# Altium schematic sheet Output.SchDoc
size A4
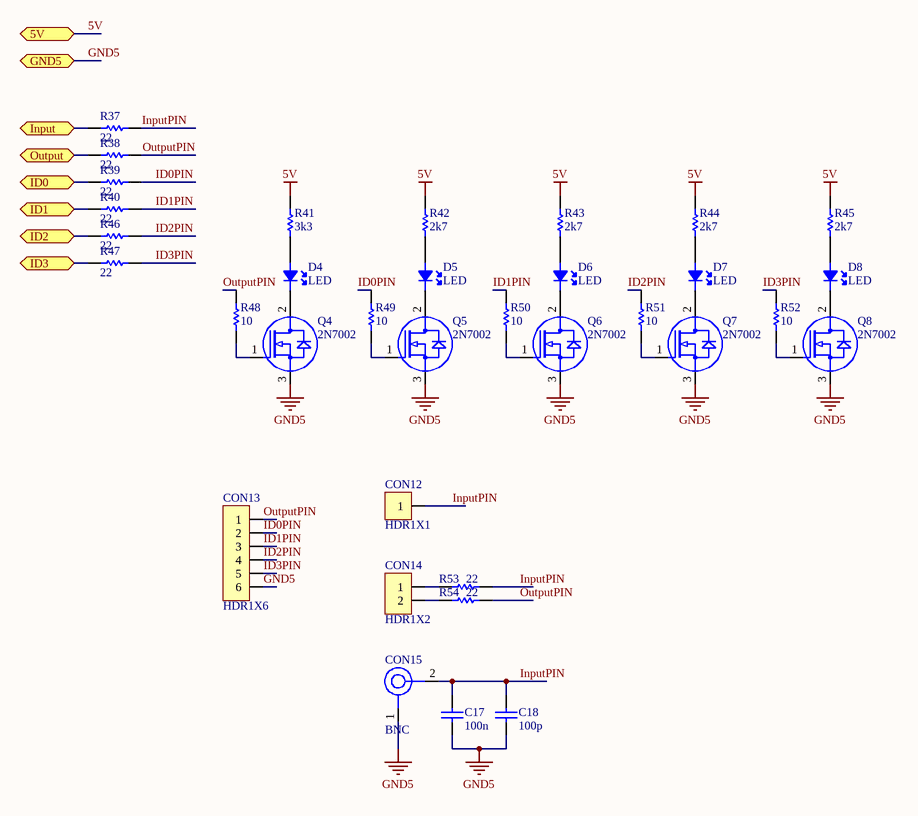
[diagram p0: Output.SchDoc]

## Parts
C17  100n  [0805C]
C18  100p  [0805C]
CON12  HDR1X1  [HDR1X1]
CON13  HDR1X6  [HDR1X6RAST]
CON14  HDR1X2  [HDR1X2RAST]
CON15  BNC  [BNC_THD]
D4  LED  [0805LED]
D5  LED  [0805LED]
D6  LED  [0805LED]
D7  LED  [0805LED]
D8  LED  [0805LED]
Q4  2N7002  [SOT23]
Q5  2N7002  [SOT23]
Q6  2N7002  [SOT23]
Q7  2N7002  [SOT23]
Q8  2N7002  [SOT23]
R37  22  [0805R]
R38  22  [0805R]
R39  22  [0805R]
R40  22  [0805R]
R41  3k3  [0805R]
R42  2k7  [0805R]
R43  2k7  [0805R]
R44  2k7  [0805R]
R45  2k7  [0805R]
R46  22  [0805R]
R47  22  [0805R]
R48  10  [0805R]
R49  10  [0805R]
R50  10  [0805R]
R51  10  [0805R]
R52  10  [0805R]
R53  22  [0805R]
R54  22  [0805R]

## Ports
5V, GND5, ID0, ID1, ID2, ID3, Input, Output

## Nets
5V: R41.2 R42.2 R43.2 R44.2 R45.2 ; port 5V
GND5: C17.1 C18.1 CON13.6 CON15.1 Q4.3(SOURCE) Q5.3(SOURCE) Q6.3(SOURCE) Q7.3(SOURCE) Q8.3(SOURCE) ; port GND5
ID0: R39.1 ; port ID0
ID0PIN: CON13.2 R39.2 R49.2
ID1: R40.1 ; port ID1
ID1PIN: CON13.3 R40.2 R50.2
ID2: R46.1 ; port ID2
ID2PIN: CON13.4 R46.2 R51.2
ID3: R47.1 ; port ID3
ID3PIN: CON13.5 R47.2 R52.2
Input: R37.1 ; port Input
InputPIN: C17.2 C18.2 CON12.1 CON15.2 R37.2 R53.2
Output: R38.1 ; port Output
OutputPIN: CON13.1 R38.2 R48.2 R54.2
NetCON14_1: CON14.1 R53.1
NetCON14_2: CON14.2 R54.1
NetD4_1: D4.1(A) R41.1
NetD4_2: D4.2(K) Q4.2(DRAIN)
NetD5_1: D5.1(A) R42.1
NetD5_2: D5.2(K) Q5.2(DRAIN)
NetD6_1: D6.1(A) R43.1
NetD6_2: D6.2(K) Q6.2(DRAIN)
NetD7_1: D7.1(A) R44.1
NetD7_2: D7.2(K) Q7.2(DRAIN)
NetD8_1: D8.1(A) R45.1
NetD8_2: D8.2(K) Q8.2(DRAIN)
NetQ4_1: Q4.1(GATE) R48.1
NetQ5_1: Q5.1(GATE) R49.1
NetQ6_1: Q6.1(GATE) R50.1
NetQ7_1: Q7.1(GATE) R51.1
NetQ8_1: Q8.1(GATE) R52.1

## Library data of the parts
C17 C18 = CAPACITOR
  C17: Value: 100n
  C18: Value: 100p
D4 = LED: COLOR: RED
D5-D8 = LED: COLOR: ORANGE
R37-R54 = RESISTOR
  R37-R40 R46 R47 R53 R54: Value: 22
  R41: Value: 3k3
  R42-R45: Value: 2k7
  R48-R52: Value: 10
CON15 = BNC: FARNELL: 1076289
Q4-Q8 = 2N7002: FARNELL: 2306371